# Altium schematic sheet 2716-2736.SchDoc
size A; SheetNumber: 1; SheetTotal: 2
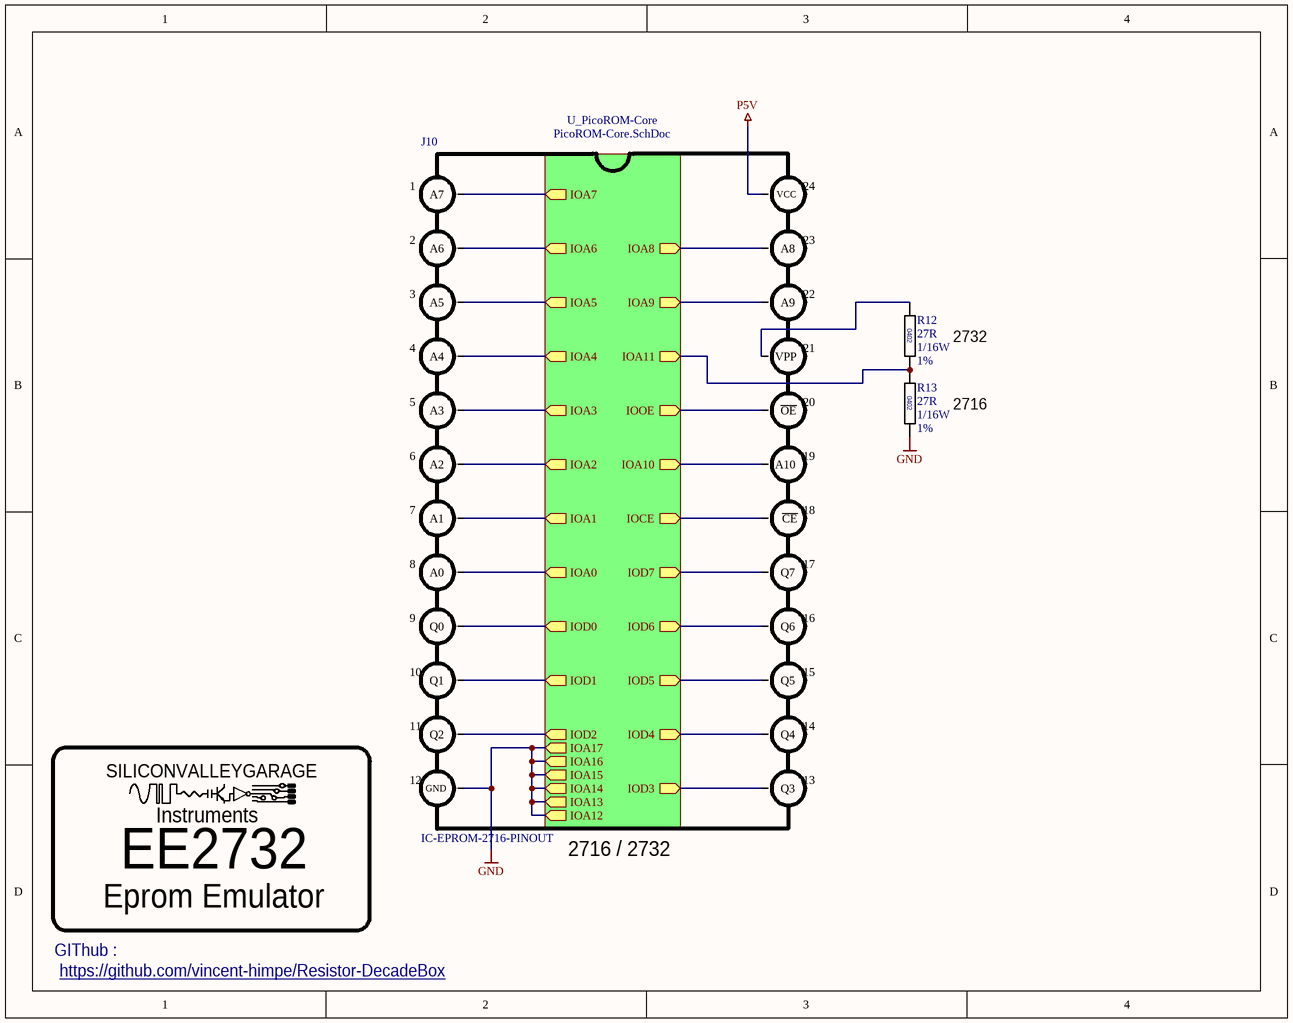
[diagram p0: 2716-2736.SchDoc]

## Parts
J10  IC-EPROM-2716-PINOUT  [DIL24-PLUG]
LOGO?  LOGO-SILICONVALLEYGARAGE-SMALL  [SILICONVALLEYGARAGE]  (value not drawn)  (graphical)
R12  value 27R  Power: 1/16W  Tolerance: 1%  [RESC0402]  (hidden comment: RESC0402)
R13  value 27R  Power: 1/16W  Tolerance: 1%  [RESC0402]  (hidden comment: RESC0402)

## Blocks framed on the sheet
EE2732: LOGO?

## Sub-sheets
U_PicoROM-Core = PicoROM-Core.SchDoc: IOA0 (out), IOA1 (out), IOA2 (out), IOA3 (out), IOA4 (out), IOA5 (out), IOA6 (out), IOA7 (out), IOA8 (out), IOA9 (out), IOA10 (out), IOA11 (out), IOA12 (out), IOA13 (out), IOA14 (out), IOA15 (out), IOD0 (out), IOD1 (out), IOD2 (out), IOD3 (out), IOD4 (out), IOD5 (out), IOD6 (out), IOD7 (out), IOCE (out), IOOE (out), IOA16 (out), IOA17 (out)

## Nets
GND: J10.12(GND) R13.1 ; sheet U_PicoROM-Core/IOA12, sheet U_PicoROM-Core/IOA13, sheet U_PicoROM-Core/IOA14, sheet U_PicoROM-Core/IOA15, sheet U_PicoROM-Core/IOA16, sheet U_PicoROM-Core/IOA17
P5V: J10.24(VCC)
NetJ10_1: J10.1(A7) ; sheet U_PicoROM-Core/IOA7
NetJ10_2: J10.2(A6) ; sheet U_PicoROM-Core/IOA6
NetJ10_3: J10.3(A5) ; sheet U_PicoROM-Core/IOA5
NetJ10_4: J10.4(A4) ; sheet U_PicoROM-Core/IOA4
NetJ10_5: J10.5(A3) ; sheet U_PicoROM-Core/IOA3
NetJ10_6: J10.6(A2) ; sheet U_PicoROM-Core/IOA2
NetJ10_7: J10.7(A1) ; sheet U_PicoROM-Core/IOA1
NetJ10_8: J10.8(A0) ; sheet U_PicoROM-Core/IOA0
NetJ10_9: J10.9(Q0) ; sheet U_PicoROM-Core/IOD0
NetJ10_10: J10.10(Q1) ; sheet U_PicoROM-Core/IOD1
NetJ10_11: J10.11(Q2) ; sheet U_PicoROM-Core/IOD2
NetJ10_13: J10.13(Q3) ; sheet U_PicoROM-Core/IOD3
NetJ10_14: J10.14(Q4) ; sheet U_PicoROM-Core/IOD4
NetJ10_15: J10.15(Q5) ; sheet U_PicoROM-Core/IOD5
NetJ10_16: J10.16(Q6) ; sheet U_PicoROM-Core/IOD6
NetJ10_17: J10.17(Q7) ; sheet U_PicoROM-Core/IOD7
NetJ10_18: J10.18(~{CE}) ; sheet U_PicoROM-Core/IOCE
NetJ10_19: J10.19(A10) ; sheet U_PicoROM-Core/IOA10
NetJ10_20: J10.20(~{OE}) ; sheet U_PicoROM-Core/IOOE
NetJ10_21: J10.21(VPP) R12.2
NetJ10_22: J10.22(A9) ; sheet U_PicoROM-Core/IOA9
NetJ10_23: J10.23(A8) ; sheet U_PicoROM-Core/IOA8
NetR12_1: R12.1 R13.2 ; sheet U_PicoROM-Core/IOA11

## Notes on the sheet
- 2732
- 2716
- (near LOGO?) Instruments
- Eprom Emulator
- (near J10) 2716 / 2732
- https://github.com/vincent-himpe/Resistor-DecadeBox
- GIThub :
- (in symbol LOGO-SILICONVALLEYGARAGE-SMALL) SILICONVALLEYGARAGE
- (in symbol RESC-0402-27R-1%-1/10W) 0402

## Library data of the parts
J10 = IC-EPROM-2716-PINOUT: CONN,DIP24,MALE PINHEADER,TURNED PIN,GOLD; Manufacturer 1: CNCTECH; Manufacturer Part Number 1: 220-1-24-006; DIGIKEY: 1175-1524-5-ND
LOGO? = LOGO-SILICONVALLEYGARAGE-SMALL: LOGO,SILICONVALLEYGARAGE,SMALL
R12 R13 = RESC-0402-27R-1%-1/10W: RESISTOR,27R,1%,63mW,0402 (1005); Location: *; LCSC: C138021; Supplier 1: Future Electronics; Supplier Part Number 1: 2577120